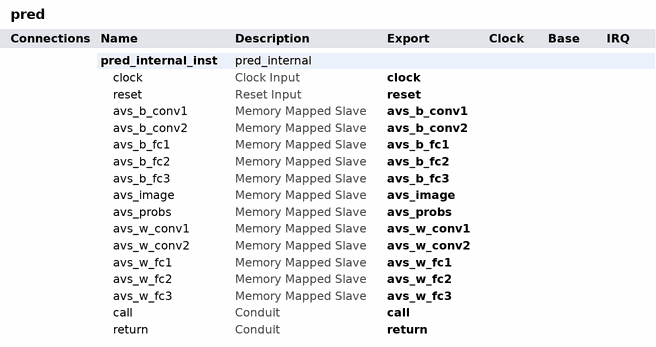
[diagram p0: system contents]
# Platform Designer (Qsys) system pred, Cyclone V 5CGXFC7C7F23C8
# Parameters at their usual value, and those the tool derives, are not listed.
package require qsys
create_system pred
set_project_property DEVICE_FAMILY {Cyclone V}
set_project_property DEVICE 5CGXFC7C7F23C8

add_instance pred_internal_inst pred_internal 1.0
set_instance_property pred_internal_inst AUTO_EXPORT true

# exported interfaces
add_interface avs_b_conv1 avalon slave
set_interface_property avs_b_conv1 EXPORT_OF pred_internal_inst.avs_b_conv1
add_interface avs_b_conv2 avalon slave
set_interface_property avs_b_conv2 EXPORT_OF pred_internal_inst.avs_b_conv2
add_interface avs_b_fc1 avalon slave
set_interface_property avs_b_fc1 EXPORT_OF pred_internal_inst.avs_b_fc1
add_interface avs_b_fc2 avalon slave
set_interface_property avs_b_fc2 EXPORT_OF pred_internal_inst.avs_b_fc2
add_interface avs_b_fc3 avalon slave
set_interface_property avs_b_fc3 EXPORT_OF pred_internal_inst.avs_b_fc3
add_interface avs_image avalon slave
set_interface_property avs_image EXPORT_OF pred_internal_inst.avs_image
add_interface avs_probs avalon slave
set_interface_property avs_probs EXPORT_OF pred_internal_inst.avs_probs
add_interface avs_w_conv1 avalon slave
set_interface_property avs_w_conv1 EXPORT_OF pred_internal_inst.avs_w_conv1
add_interface avs_w_conv2 avalon slave
set_interface_property avs_w_conv2 EXPORT_OF pred_internal_inst.avs_w_conv2
add_interface avs_w_fc1 avalon slave
set_interface_property avs_w_fc1 EXPORT_OF pred_internal_inst.avs_w_fc1
add_interface avs_w_fc2 avalon slave
set_interface_property avs_w_fc2 EXPORT_OF pred_internal_inst.avs_w_fc2
add_interface avs_w_fc3 avalon slave
set_interface_property avs_w_fc3 EXPORT_OF pred_internal_inst.avs_w_fc3
add_interface call conduit end
set_interface_property call EXPORT_OF pred_internal_inst.call
add_interface clock clock sink
set_interface_property clock EXPORT_OF pred_internal_inst.clock
add_interface reset reset sink
set_interface_property reset EXPORT_OF pred_internal_inst.reset
add_interface return conduit end
set_interface_property return EXPORT_OF pred_internal_inst.return

set_interconnect_requirement {$system} qsys_mm.clockCrossingAdapter HANDSHAKE
set_interconnect_requirement {$system} qsys_mm.enableEccProtection FALSE
set_interconnect_requirement {$system} qsys_mm.insertDefaultSlave FALSE
set_interconnect_requirement {$system} qsys_mm.maxAdditionalLatency 1

save_system pred.qsys
